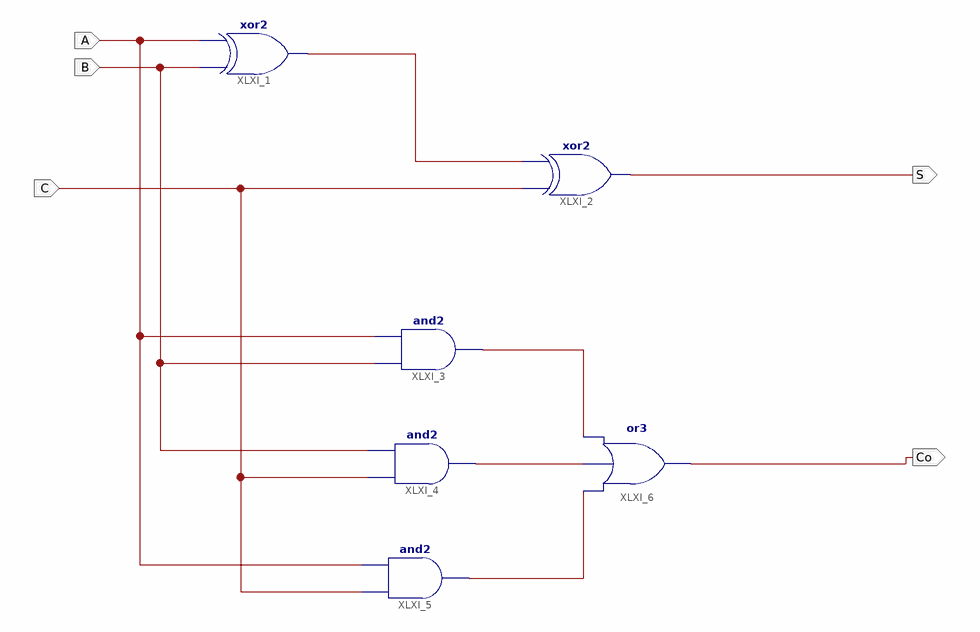
[diagram p0: schematic sheet 1]
// Xilinx ISE schematic Adder1b.sch (kintex7) as structural Verilog: 6 symbols, 5 ports
module Adder1b (
  input  C,
  input  A,
  input  B,
  output S,
  output Co
);

  wire XLXN_1, XLXN_8, XLXN_9, XLXN_10;

  xor XLXI_1 (XLXN_1, B, A);
  xor XLXI_2 (S, C, XLXN_1);
  and XLXI_3 (XLXN_9, B, A);
  and XLXI_4 (XLXN_8, C, B);
  and XLXI_5 (XLXN_10, C, A);
  or XLXI_6 (Co, XLXN_10, XLXN_8, XLXN_9);
endmodule
